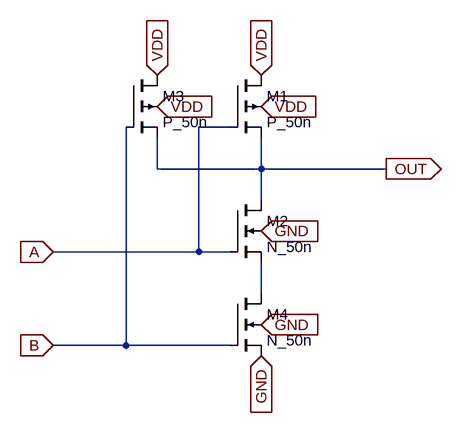
[diagram p0: schematic NAN2.asc]
NAN2.asc, the LTspice schematic file:
Version 4.1
SHEET 1 880 680
WIRE 64 48 16 48
WIRE -48 112 -48 64
WIRE 112 112 112 64
WIRE 112 112 -48 112
WIRE 304 112 112 112
WIRE 112 160 112 112
WIRE 16 240 16 48
WIRE 16 240 -208 240
WIRE 64 240 16 240
WIRE 112 304 112 256
WIRE -96 384 -96 48
WIRE -96 384 -208 384
WIRE 64 384 -96 384
FLAG -48 -32 VDD
IOPIN -48 -32 In
FLAG -48 16 VDD
IOPIN -48 16 In
FLAG 112 16 VDD
IOPIN 112 16 In
FLAG 112 -32 VDD
IOPIN 112 -32 In
FLAG 112 352 GND
IOPIN 112 352 In
FLAG 112 400 GND
IOPIN 112 400 In
FLAG 112 208 GND
IOPIN 112 208 In
FLAG -208 240 A
IOPIN -208 240 In
FLAG -208 384 B
IOPIN -208 384 In
FLAG 304 112 OUT
IOPIN 304 112 Out
SYMBOL pmos4 64 -32 R0
SYMATTR InstName M1
SYMATTR Value P_50n
SYMATTR Value2 l=50n w=6u
SYMBOL nmos4 64 160 R0
SYMATTR InstName M2
SYMATTR Value N_50n
SYMATTR Value2 l=50n w=4u
SYMBOL pmos4 -96 -32 R0
SYMATTR InstName M3
SYMATTR Value P_50n
SYMATTR Value2 l=50n w=6u
SYMBOL nmos4 64 304 R0
SYMATTR InstName M4
SYMATTR Value N_50n
SYMATTR Value2 l=50n w=4u

The netlist it stands for:
* NAN2.asc
M1 VDD A OUT VDD P_50n l=50n w=6u
M2 OUT A N001 GND N_50n l=50n w=4u
M3 VDD B OUT VDD P_50n l=50n w=6u
M4 N001 B GND GND N_50n l=50n w=4u
.model NMOS NMOS
.model PMOS PMOS
.lib standard.mos
.backanno
.end